# Altium schematic sheet SubTriggerIn.SchDoc
size Letter; DocumentNumber: 7; SheetNumber: 7; SheetTotal: 7
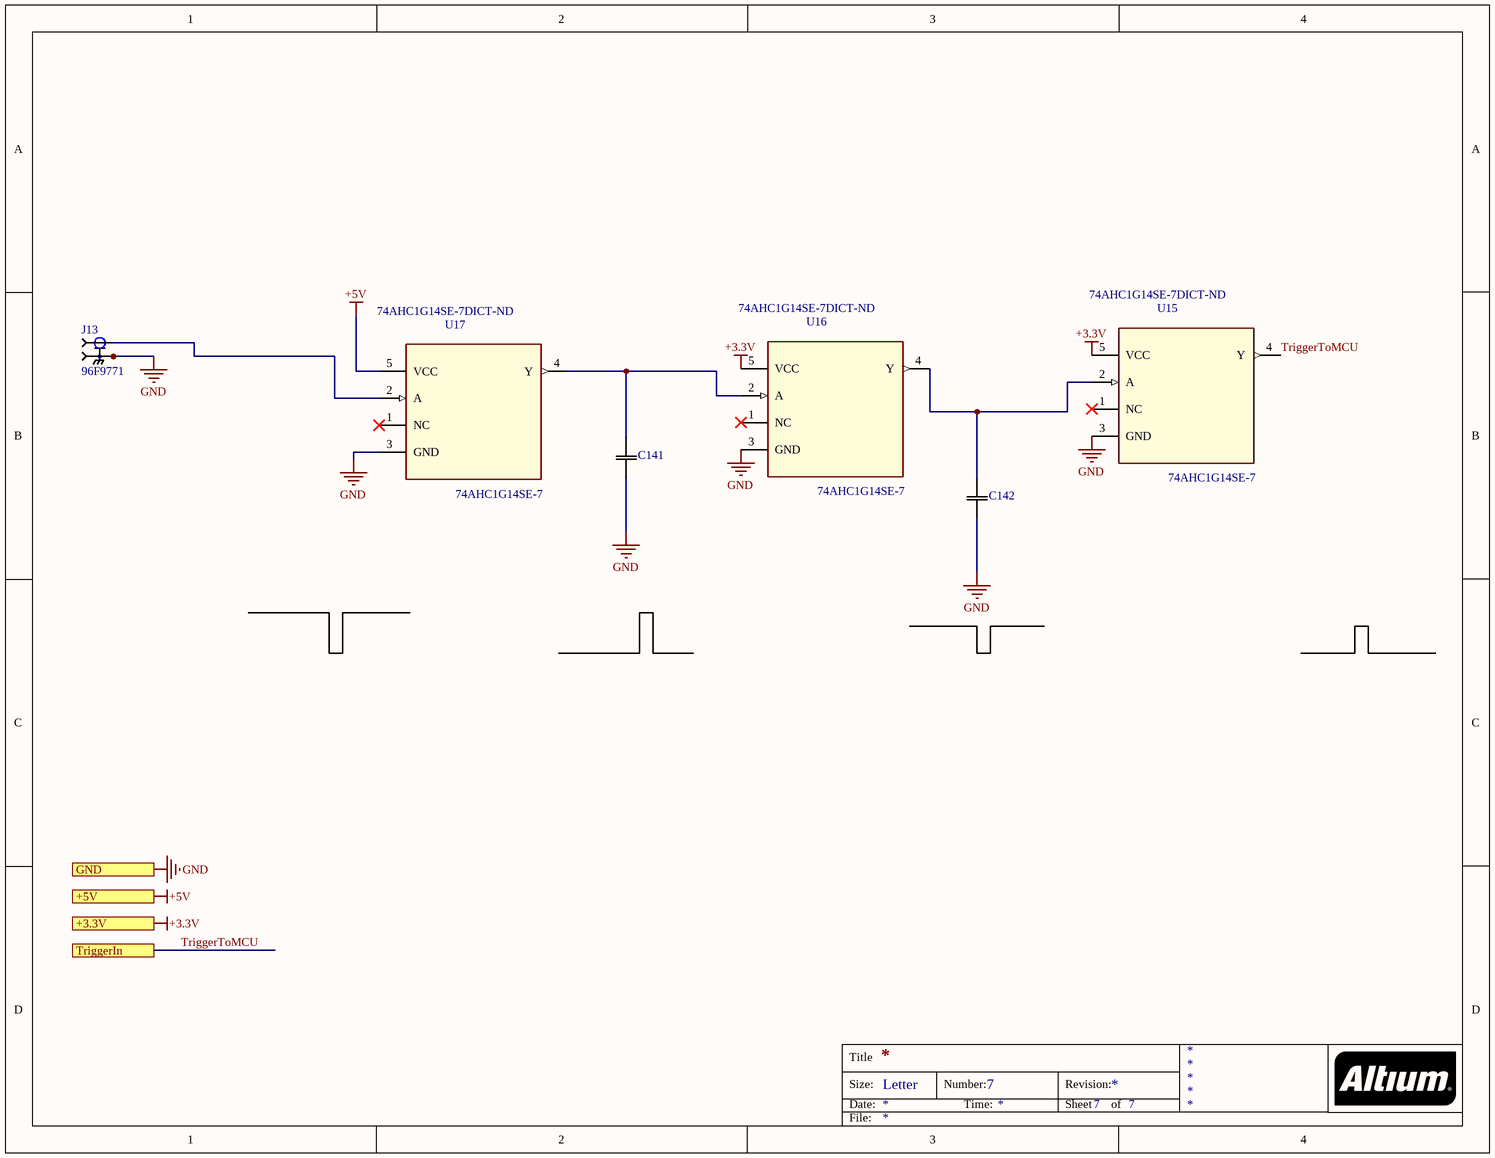
[diagram p0: SubTriggerIn.SchDoc]

## Parts
C141  GRM155R71C103MA01D  [C0402]  (value not drawn)
C142  GRM155R71C103MA01D  [C0402]  (value not drawn)
J13  Supplier Part Number 1: 96F9771  [SMBboardEdge]  (hidden comment: 131-3701-801)
U15  74AHC1G14SE-7  Supplier Part Number 1: 74AHC1G14SE-7DICT-ND  [*SOT65P210X110-5N]
U16  74AHC1G14SE-7  Supplier Part Number 1: 74AHC1G14SE-7DICT-ND  [*SOT65P210X110-5N]
U17  74AHC1G14SE-7  Supplier Part Number 1: 74AHC1G14SE-7DICT-ND  [*SOT65P210X110-5N]

## Ports
+3.3V, +5V, GND, TriggerIn

## Nets
+3.3V: U15.5(VCC) U16.5(VCC) ; port +3.3V
+5V: U17.5(VCC) ; port +5V
GND: C141.1 C142.1 J13.SH1 J13.SH2 J13.SH3 J13.SH4 U15.3(GND) U16.3(GND) U17.3(GND) ; port GND
TriggerToMCU: U15.4(Y) ; port TriggerIn
NetC141_2: C141.2 U16.2(A) U17.4(Y)
NetC142_2: C142.2 U15.2(A) U16.4(Y)
NetJ13_1: J13.1 U17.2(A)

Not connected (* = marked no-connect by the designer): U15 1(NC)*; U16 1(NC)*; U17 1(NC)*

## Notes on the sheet
- Title
- Size:
- Date:
- Letter
- Number:
- Time:
- Revision:
- Sheet
- of
- File:

## Library data of the parts
C141 C142 = Cap_0402: Supplier 1: Digi-Key; Supplier Part Number 1: 490-16353-1-ND
J13 = SMB: SMB Connector Jack, Male Pin 50Ohm Board Edge, End Launch Solder; Supplier 1: Newark
U15-U17 = 74AHC1G14SE-7: Inverter IC 1 Channel Schmitt Trigger SOT-353; MF: Diodes Inc.; Package: SOT-353 Diodes Inc.; MP: 74AHC1G14SE-7; Digi-Key_Part_Number: 74AHC1G14SE-7DICT-ND; Digi-Key_Purchase_URL: https://www.digikey.ca/product-detail/en/diodes-incorporated/74AHC1G14SE-7/74AHC1G14SE-7DICT-ND/2639309?utm_source=snapeda&utm_medium=aggregator&utm_campaign=symbol; SnapEDA_Link: https://www.snapeda.com/parts/74AHC1G14SE-7/Diodes%20Inc./view-part/418511/?ref=snap; Value: *; Supplier 1: Digi-Key